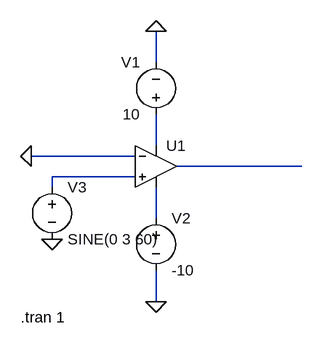
[diagram p0: schematic OP_Amp.asc]
OP_Amp.asc, the LTspice schematic file:
Version 4.1
SHEET 1 880 680
WIRE 144 -32 144 -80
WIRE 144 96 144 48
WIRE 112 112 -48 112
WIRE 368 128 176 128
WIRE 112 144 -16 144
WIRE -16 160 -16 144
WIRE 144 208 144 160
WIRE 144 336 144 288
FLAG 144 336 0
FLAG -48 112 0
FLAG -16 240 0
FLAG 144 -80 0
SYMBOL OpAmps\\UniversalOpAmp2 144 128 R0
SYMATTR InstName U1
SYMBOL voltage 144 192 R0
WINDOW 123 0 0 Left 0
WINDOW 39 0 0 Left 0
SYMATTR InstName V2
SYMATTR Value -10
SYMBOL voltage -16 144 R0
WINDOW 123 0 0 Left 0
WINDOW 39 0 0 Left 0
SYMATTR InstName V3
SYMATTR Value SINE(0 3 60)
SYMBOL voltage 144 64 R180
WINDOW 0 24 96 Left 2
WINDOW 3 24 16 Left 2
WINDOW 123 0 0 Left 0
WINDOW 39 0 0 Left 0
SYMATTR InstName V1
SYMATTR Value 10
TEXT -64 360 Left 2 !.tran 1

The netlist it stands for:
* OP_Amp.asc
X§U1 N003 0 N001 N004 N002 level2 Avol=1Meg GBW=10Meg Slew=10Meg Ilimit=25m Rail=0 Vos=0 En=0 Enk=0 In=0 Ink=0 Rin=500Meg  ; pins In+ In- V+ V- OUT
V2 N004 0 -10
V3 N003 0 SINE(0 3 60)
V1 N001 0 10
.tran 1
.lib UniversalOpAmp2.lib
.backanno
.end